# Altium project ZeroCrossDetector.PrjPcb
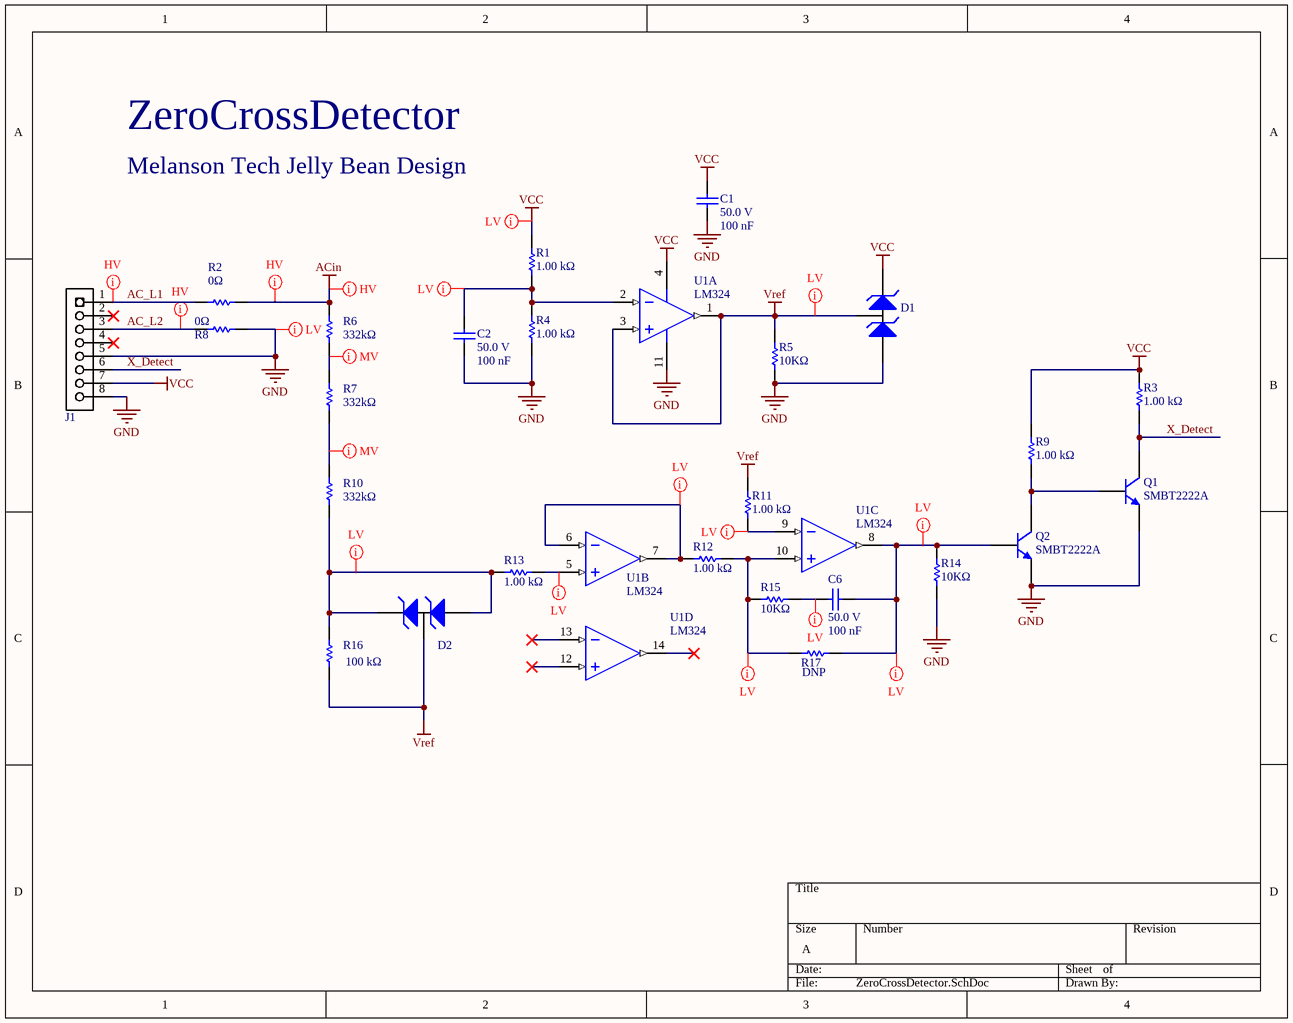
[diagram p0: ZeroCrossDetector.SchDoc]
1 sheet, 27 parts. Net scope: global (net labels, ports and power ports of the same name join across sheets).

## Sheet ZeroCrossDetector.SchDoc
size A

### Parts
C1  Voltage Rating (DC): 50.0 V  Capacitance: 100 nF  [Cap,0805]  (hidden comment: 08055C104JAT2A)
C2  Voltage Rating (DC): 50.0 V  Capacitance: 100 nF  [Cap,0805]  (hidden comment: 08055C104JAT2A)
C6  Voltage Rating (DC): 50.0 V  Capacitance: 100 nF  [Cap,0805]  (hidden comment: 08055C104JAT2A)
D1  BAT54SLT1G  [SOT23-3]  (value not drawn)
D2  BAT54SLT1G  [SOT23-3]  (value not drawn)
J1  HEADER,0.1",8Pin,SinlgeRow  [Header,8Pin,SingleRow, RA,0.1"]  (value not drawn)
Logo1  Open Source Logo  [Symbol,Open Source]  (value not drawn)
Q1  SMBT2222A  [SOT23-3]
Q2  SMBT2222A  [SOT23-3]
R1  Resistance: 1.00 kΩ  [res, 0805, HD]  (hidden comment: Vishay CRCW08051K00JNEA)
R2  Resistance: 0Ω  [Res,1206]  (hidden comment: Res1)
R3  Resistance: 1.00 kΩ  [res, 0805, HD]  (hidden comment: Vishay CRCW08051K00JNEA)
R4  Resistance: 1.00 kΩ  [res, 0805, HD]  (hidden comment: Vishay CRCW08051K00JNEA)
R5  Resistance: 10KΩ  [res, 0805, HD]  (hidden comment: Vishay / Dale CRCW080510K0FKTA)
R6  Resistance: 332kΩ  [res, 0805, HD]  (hidden comment: RT0805BRD07332KL)
R7  Resistance: 332kΩ  [res, 0805, HD]  (hidden comment: RT0805BRD07332KL)
R8  Resistance: 0Ω  [Res,1206]  (hidden comment: Res1)
R9  Resistance: 1.00 kΩ  [res, 0805, HD]  (hidden comment: Vishay CRCW08051K00JNEA)
R10  Resistance: 332kΩ  [res, 0805, HD]  (hidden comment: RT0805BRD07332KL)
R11  Resistance: 1.00 kΩ  [res, 0805, HD]  (hidden comment: Vishay CRCW08051K00JNEA)
R12  Resistance: 1.00 kΩ  [res, 0805, HD]  (hidden comment: Vishay CRCW08051K00JNEA)
R13  Resistance: 1.00 kΩ  [res, 0805, HD]  (hidden comment: Vishay CRCW08051K00JNEA)
R14  Resistance: 10KΩ  [res, 0805, HD]  (hidden comment: Vishay / Dale CRCW080510K0FKTA)
R15  Resistance: 10KΩ  [res, 0805, HD]  (hidden comment: Vishay / Dale CRCW080510K0FKTA)
R16  Resistance: 100 kΩ  [res, 0805, HD]  (hidden comment: CRCW0805100KFKEA)
R17  DNP  [res, 0805, HD]
U1  Mfg P/N: LM324  [SOIC-14]  (hidden comment: LM324ADR2G)  (parts A,B,C,D of 4)

### Nets
ACin: R2.2 R6.2
GND: C1.1 C2.1 D1.1(A) J1.5 J1.8 Q1.2(E) Q2.2(E) R4.2 R5.1 R8.1 R14.1 U1.11(GND)
VCC: C1.2 D1.2(K) J1.7 R1.1 R3.2 R9.2 U1.4(VCC)
Vref: D1.3(AK) D2.3(AK) R5.2 R11.2 R16.1 U1.1(OUT1) U1.3(IN1+)
AC_L1: J1.1 R2.1
AC_L2: J1.3 R8.2
X_Detect: J1.6 Q1.3(C) R3.1
NetC2_2: C2.2 R1.2 R4.1 U1.2(IN1-)
NetC6_1: C6.1 Q2.1(B) R14.2 R17.1 U1.8(OUT3)
NetC6_2: C6.2 R15.2
NetD2_1: D2.1(A) D2.2(K) R10.1 R13.1 R16.2
NetQ1_1: Q1.1(B) Q2.3(C) R9.1
NetR6_1: R6.1 R7.2
NetR7_1: R7.1 R10.2
NetR11_1: R11.1 U1.9(IN3-)
NetR12_1: R12.1 U1.6(IN2-) U1.7(OUT2)
NetR12_2: R12.2 R15.1 R17.2 U1.10(IN3+)
NetR13_2: R13.2 U1.5(IN2+)

Not connected (* = marked no-connect by the designer): J1 2* 4*; U1 12(IN4+)* 13(IN4-)* 14(OUT4)*

### Layout directives
net class HighVolt; net class HVinA: AC_L1
net class MidVolt: NetR6_1, NetR7_1
net class LowVolt: GND, NetC2_2, NetC6_1, NetC6_2, NetD2_1, NetR11_1, NetR12_1, NetR12_2, NetR13_2, VCC, Vref
HighVolt: ClassName: ACin
net class HighVolt: ACin
net class HighVolt; net class HVinB: AC_L2

### Notes on the sheet
- ZeroCrossDetector
- Melanson Tech Jelly Bean Design

### Library data of the parts
C1 C2 C6 = Cap,0805,100nf,50V,5%,08055C104JAT2A: Capacitor; Ceramic; Cap 0.1 uF; Tol 5%; Vol-Rtg 50 VDC; SMT; 0805; X7R; Tape & Reel; Lead-Free Status: Lead Free; Case/Package (SI): 2012; Insulation Resistance: 100 GΩ; Detailed Description: 0.1µF ±5% 50V Ceramic Capacitor X7R 0805 (2012 Metric); Mounting Style: Surface Mount; Packaging: Tape & Reel (TR), Cut Tape (CT); RoHS: Compliant; Size-Width: 1.24 mm; Case/Package: 0805; Number of Pins: 2; digikey url: http://www.digikey.ca/product-detail/en/avx-corporation/08055C104JAT2A/478-3352-1-ND/930144; REACH SVHC Compliance: No SVHC; Dielectric Characteristic: X7R; Capacitance Tolerance: ±5%; Size-Length: 2.01 mm; Size-Height: 710 µm; Size-Thickness: 940 µm; Manufacturer Part Number: 08055C104JAT2A; Octopart URL: http://octopart.com/08055c104jat2a-avx-55388010; Operating Temperature: -55°C ~ 125°C; Supplier 1: Digi-Key; Supplier Part Number 1: 478-3352-1-ND
D1 D2 = Diode,Shottky,Array,Series,30V,200mA,BAT54SLT1G: Diode Array 1 Pair Series Connection Schottky 30V 200mA (DC) Surface Mount TO-236-3, SC-59, SOT-23-3; Manufacturer: ON Semiconductor; Voltage - Forward (Vf) (Max) @ If: 800mV @ 100mA; Speed: Small Signal =< 200mA (Io), Any Speed; Reverse Recovery Time (trr): 5ns; Current - Reverse Leakage @ Vr: 2µA @ 25V; Detailed Description: Diode Array 1 Pair Series Connection Schottky 30V 200mA (DC) Surface Mount TO-236-3, SC-59, SOT-23-3; mfg P/N: BAT54SLT1G; Diode Type: Schottky; Diode Configuration: 1 Pair Series Connection; Voltage - DC Reverse (Vr) (Max): 30V; Current - Average Rectified (Io) (per Diode): 200mA (DC); Operating Temperature - Junction: 125°C (Max); Mounting Type: Surface Mount; Package / Case: TO-236-3, SC-59, SOT-23-3; Supplier Device Package: SOT-23-3 (TO-236); Base Part Number: BAT54SL; Supplier 1: Digi-Key; Supplier Part Number 1: BAT54SLT1GOSCT-ND; Supplier 2: LCSC; Supplier Part Number 2: C19726
Logo1 = Symbol,Open Source: Open Source Silk Screen Logo
Q1 Q2 = Trans,40V,600mA,0.33W, SMBT2222A: NPN Silicon Switching Transistor, 40 V VCEO, 600 mA IC, SOT23, Reel, Green; Power Dissipation: 0.33 W; Voltage - Collector Emitter Breakdown (Max): 40V; Vce Saturation (Max) @ Ib, Ic: 1V @ 50mA, 500mA; Current - Collector Cutoff (Max): 10nA (ICBO); DC Current Gain (hFE) (Min) @ Ic, Vce: 100 @ 150mA, 10V; Frequency - Transition: 300MHz; Mounting Style: Surface Mount; Number of Pins: 3; Packaging: Cut Tape (CT); Polarity: NPN; REACH SVHC Compliance: No SVHC; RoHS: Compliant; Mounting Type: Surface Mount; Package / Case: TO-236-3, SC-59, SOT-23-3; Supplier Device Package: SOT-23-3; Supplier 1: Digi-Key; Supplier Part Number 1: SMBT2222AE6327HTSA1CT-ND; Supplier 2: Digi-Key; Supplier Part Number 2: MMBT2222ALT1HTSA1CT-ND; Supplier 3: Digi-Key; Supplier Part Number 3: SMBT2222AE6327HTSA1DKR-ND; Supplier 4: LCSC; Supplier Part Number 4: C151510; mfg P/N: SMBT2222A
R1 R3 R4 R9 R11-R13 = Res,0805,1.00 kΩ,5%,200ppm,CRCW08051K00JNEA: Res Thick Film 0805 1K Ohm 5% 0.125W(1/8W) ±200ppm/C Molded SMD Automotive Paper T/R; Power Rating: 125 mW; Case/Package (SI): 2012; Lead-Free Status: Lead Free; Temperature Coefficient: 200 ppm/°C; Voltage Rating (DC): 150 V; Size-Width: 1.25 mm; Mounting Style: Surface Mount; REACH SVHC Compliance: No SVHC; Manufacturer Part Number: CRCW08051K00JNEA; Number of Pins: 2; Size-Height: 450 µm; Packaging: Tape & Reel (TR), Cut Tape (CT); RoHS: Compliant; Resistance Tolerance: ±5%; Case/Package: 0805; Size-Length: 2.00 mm; Supplier 1: Digi-Key; Supplier Part Number 1: 541-1.0KADKR-ND; Supplier 2: Digi-Key; Supplier Part Number 2: 541-1.0KACT-ND
R2 R8 = Res,1206,Generic
R5 R14 R15 = Res,0805,10.0kΩ,1%,100 ppm,CRCW080510K0FKTA: RES SMD 10K OHM 1% 1/8W 0805; Temperature Coefficient: 100.0 ppm/C; Lead-Free Status: Contains Lead; Voltage Rating (DC): 150.0 V; Power Rating: 0.125 W; Case/Package (SI): 2012; Size-Width: 0.00125 m; Resistance Tolerance: 1%; Size-Length: 0.002 m; RoHS: Non-Compliant; Power Dissipation: 0.125 W; Number of Pins: 2; REACH SVHC Compliance: No SVHC; Size-Height: 0.00045 m; Case/Package: 0805; Mounting Style: Surface Mount; Supplier 1: Digi-Key; Supplier Part Number 1: 541-3016-1-ND
R6 R7 R10 = Res,0805,332k,0.1%,±25ppm/°C,RT0805BRD07332KL: Thin Film Resistors - SMD 1/8W 332K ohm .1% 25ppm; Lead-Free Status: Lead Free; Power Rating: 0.125 W; Voltage Rating (DC): 150.0 V; Resistance Tolerance: ±0.1%; Case/Package: 0805; Mounting Style: Surface Mount; RoHS: Compliant; Size-Height: 0.0005 m; Size-Length: 0.002 m; Size-Width: 0.00125 m; mfg P/N: RT0805BRD07332KL; Supplier 1: Digi-Key; Supplier Part Number 1: YAG1869CT-ND; Temperature Coefficient: ±25ppm/°C
R16 = Res,0805,100kΩ,1%,100ppm,CRCW0805100KFKEA: 100 kOhms ±1% 0.125W, 1/8W Chip Resistor 0805 (2012 Metric) Thick Film; Manufacturer: Vishay; Lead-Free Status: Lead Free; Case/Package (SI): 2012; Power Rating: 125 mW; Temperature Coefficient: -100 ppm/°C to 100 ppm/°C; Resistance Tolerance: ±1%; RoHS: Compliant; Manufacturer Part Number: CRCW0805100KFKEA; Number of Pins: 2; Size-Length: 2.00 mm; Packaging: Tape & Reel (TR), Reel, Cut Tape (CT); Size-Height: 450 µm; Case/Package: 0805; Size-Width: 1.25 mm; Operating Temperature: 150 °C (max); Supplier 1 Part Number: 679-0803; Supplier 1: RS; Supplier 2: Digi-Key; Supplier Part Number 2: 541-100KCCT-ND
R17 = Res,0805,Generic: Resistance: ?; Tolerance: *; PPM: *; Wattage: *
U1 = OPAMP, Quad circuit, 1Mhz, SOIC-14,SMD, LM324ADR2G: Single Supply Quad Operational Amplifier, 3 to 32 V, 0 to 70 degC, 14-Pin SOIC, Pb-Free, Tape and Reel; Bandwidth: 1MHz; Lead-Free Status: Lead Free; Number of Channels: 4; Slew Rate: 0.6 V/μs; Case/Package: SOIC; Halogen Free Status: Halogen Free; Lifecycle Status: Active; Mounting Style: Surface Mount; Number of Circuits: 4; Number of Pins: 14; Packaging: Cut Tape (CT); RoHS: Compliant; Supplier 1: Digi-Key; Supplier Part Number 1: LM324ADR2GOSCT-ND; Supplier 2: LCSC; Supplier Part Number 2: C81465
J1 = HEADER,0.1",8Pin,SinlgeRow: Supplier 1: Digi-Key; Supplier Part Number 1: S1011E-36-ND